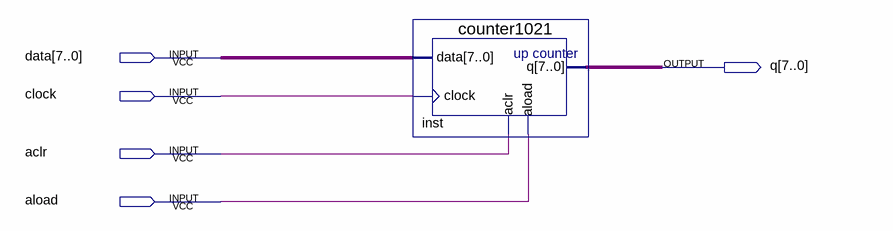
[diagram p0: schematic sheet]
// Quartus schematic Block1.bdf as structural Verilog: 1 symbols, 5 pins
module Block1 (
  input  [7:0] data,
  input  clock,
  input  aclr,
  input  aload,
  output [7:0] q
);

  counter1021 inst (.data(data), .clock(clock), .aclr(aclr), .aload(aload), .q(q));
endmodule
